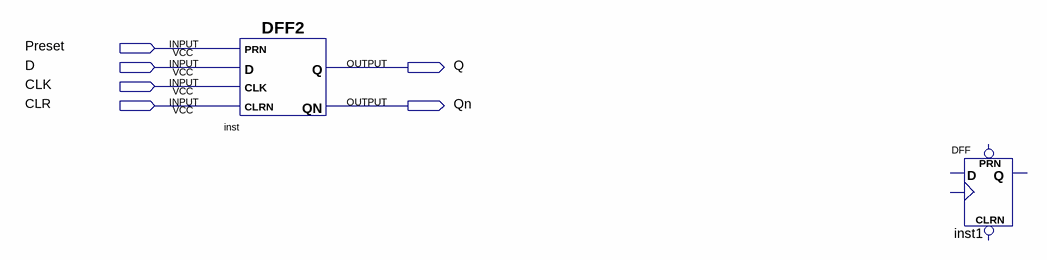
[diagram p0: schematic sheet]
// Quartus schematic DtypeFF.bdf as structural Verilog: 2 symbols, 6 pins
module DtypeFF (
  input  Preset,
  input  D,
  input  CLK,
  input  CLR,
  output Q,
  output Qn
);

  DFF2 inst (.CLK(CLK), .D(D), .PRN(Preset), .CLRN(CLR), .Q(Q), .QN(Qn));
  DFF inst1 ();  // open: CLRN, CLK, D, PRN, Q
endmodule
